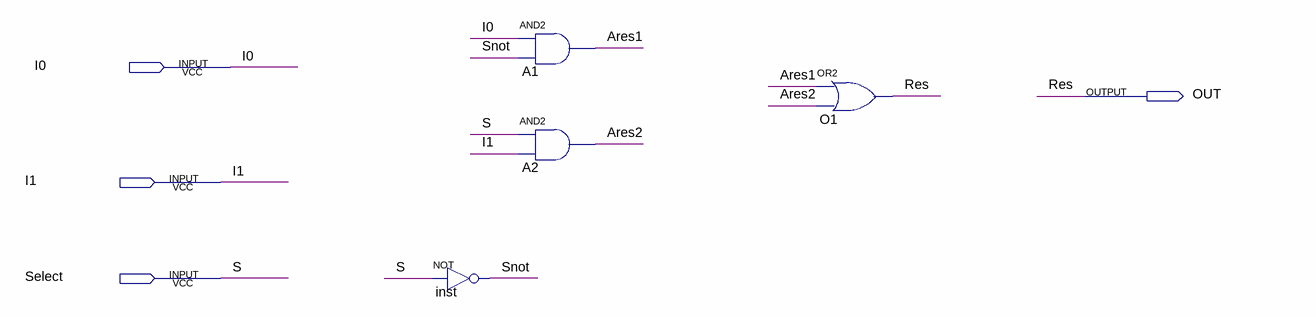
[diagram p0: schematic sheet]
// Quartus schematic my21mux.bdf as structural Verilog: 4 symbols, 4 pins
module my21mux (
  input  I0,
  input  I1,
  input  Select,
  output OUT
);

  wire Ares1, Ares2, Snot;

  not inst (Snot, Select);
  and A1 (Ares1, I0, Snot);
  and A2 (Ares2, Select, I1);
  or O1 (OUT, Ares1, Ares2);

  // Other names for the same wires on the sheet: Res = OUT; S = Select
endmodule
